# EAGLE schematic dengenver2.0 (EAGLE 9.6.2)
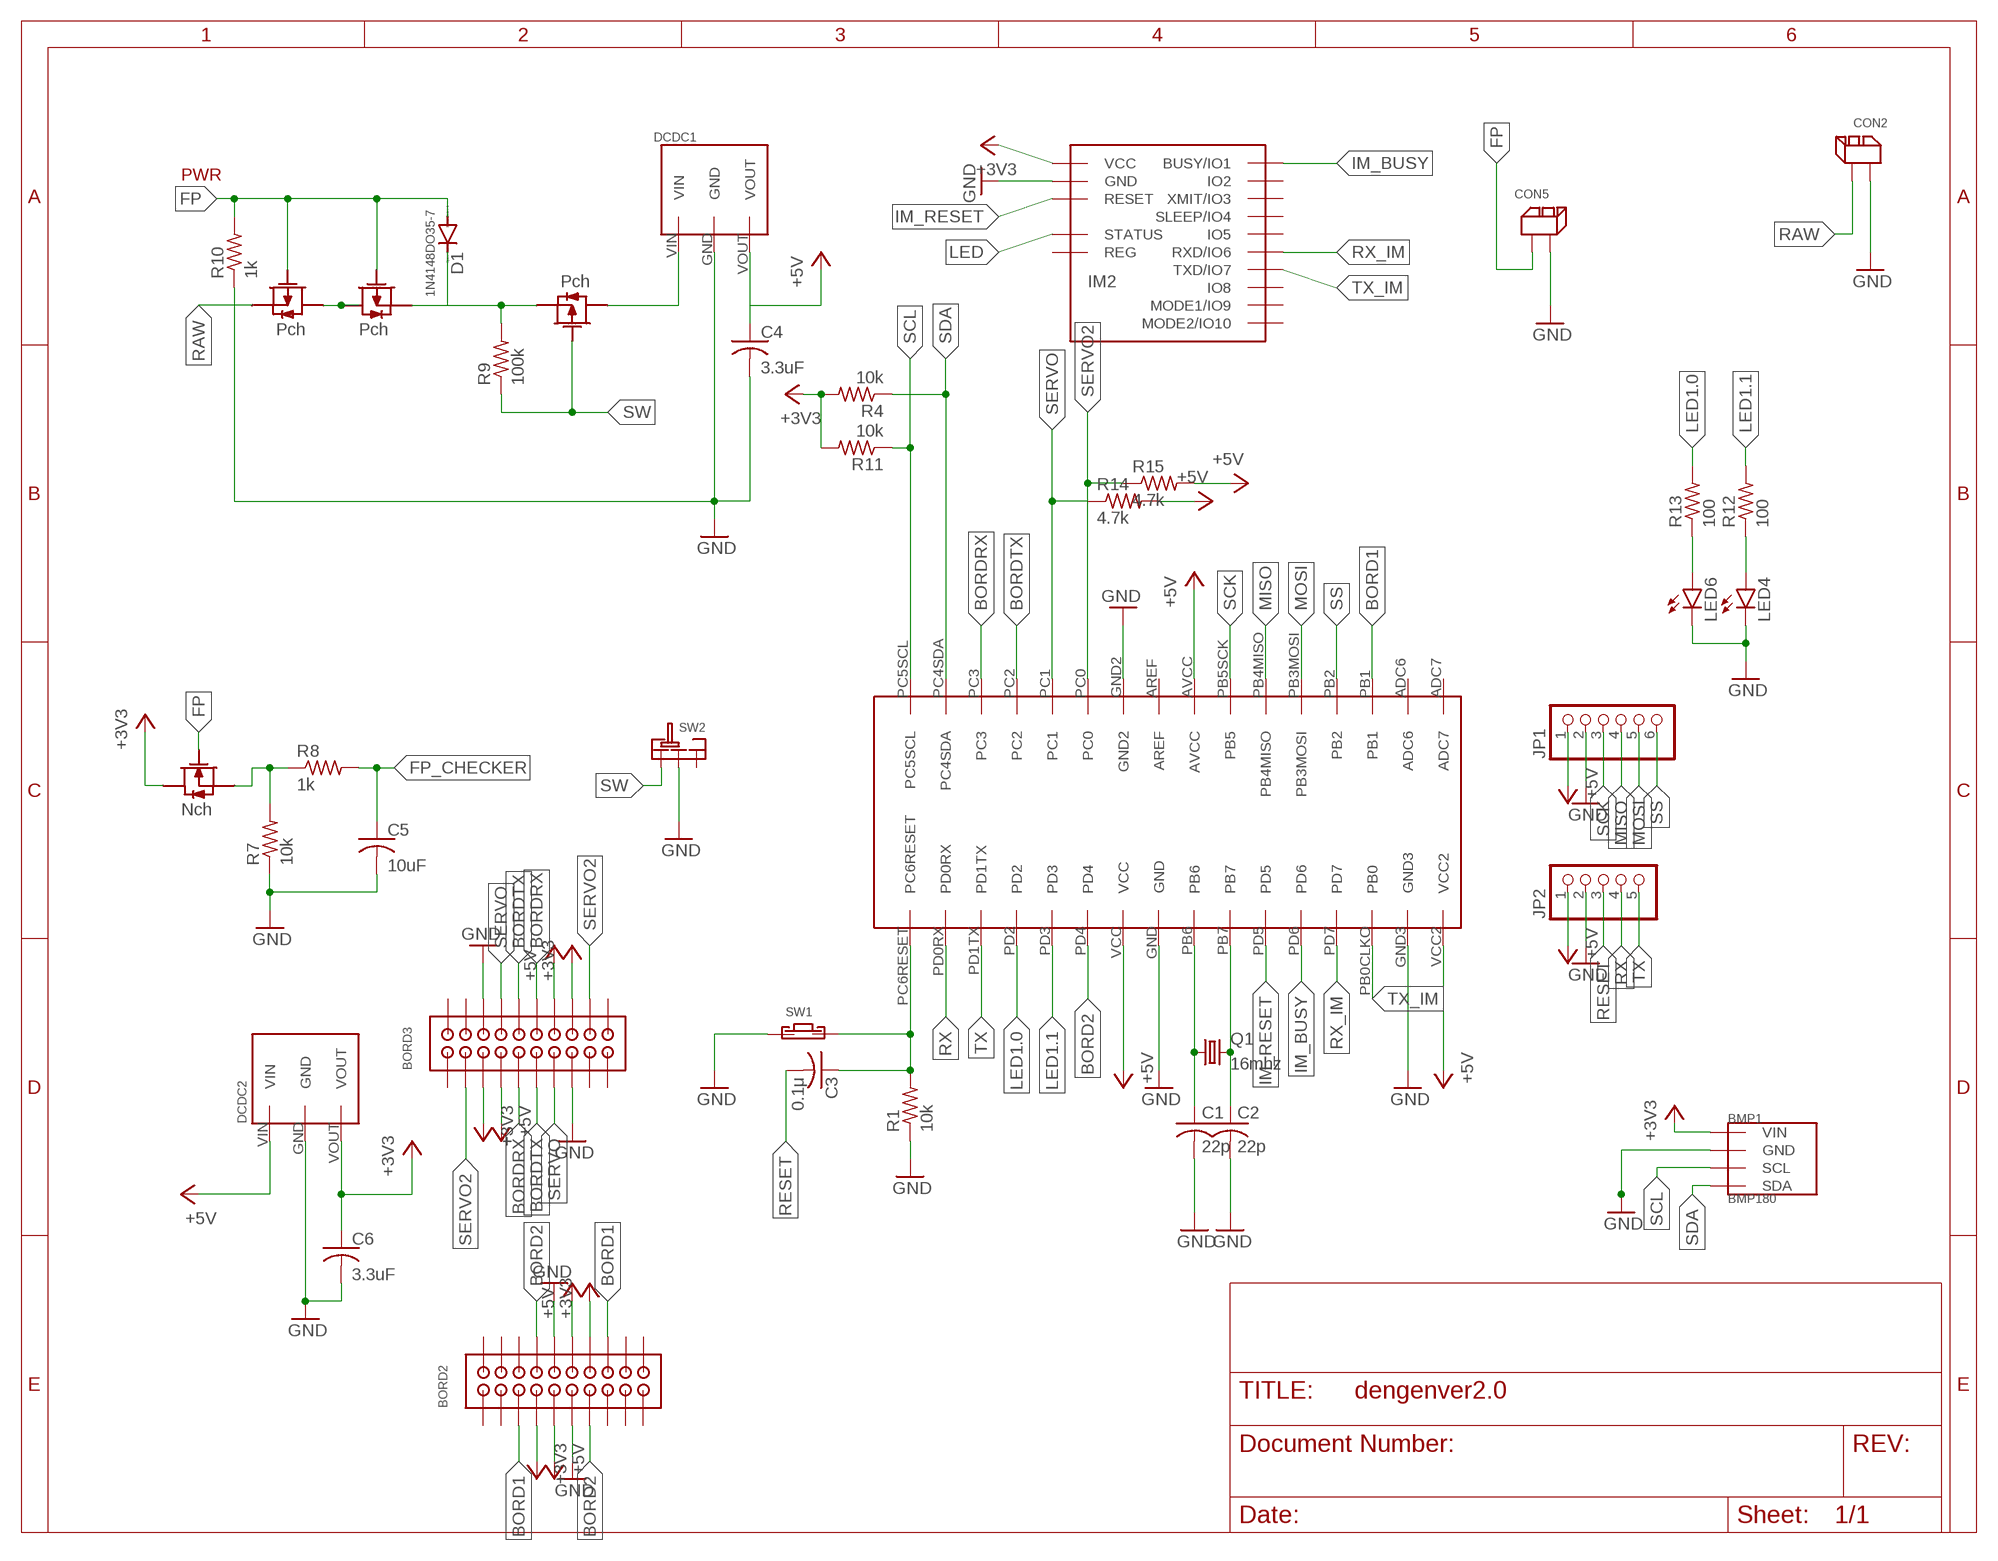
[diagram p0: schematic, sheet 1]

## Parts
BMP1  BMP180  [GY-68]
BORD2  2X10  [2X10]
BORD3  2X10  [2X10]
C1  22p  C-USC1608  [C1608]
C2  22p  C-USC1608  [C1608]
C3  0.1μ  C-USC1608  [C1608]
C4  3.3uF  C-USC1608  [C1608]
C5  10uF  C-USC1608  [C1608]
C6  3.3uF  C-USC1608  [C1608]
CON2  2PIN  [2PIN]
CON5  2PIN  [2PIN]
D1  1N4148DO35-7  [DO35-7]
DCDC1  5V1A_M78AR05-1  [5V1A_M78AR05-1]
DCDC2  3.3V1A_M78AR033-1  [3.3V1A_M78AR033-1]
IM2  IM920_IM920C  [IM920_IM920C]
JP1  PINHD-1X6  [1X06]
JP2  PINHD-1X5  [1X05]
LED4  LED5MM  [LED5MM]
LED6  LED5MM  [LED5MM]
Q1  16mhz  CRYSTALHC49UP  [HC49UP]
R1  10k  R-US_R0603  [R0603]
R4  10k  R-US_R0603  [R0603]
R7  10k  R-US_R0603  [R0603]
R8  1k  R-US_R0603  [R0603]
R9  100k  R-US_R0603  [R0603]
R10  1k  R-US_R0603  [R0603]
R11  10k  R-US_R0603  [R0603]
R12  100  R-US_R0603  [R0603]
R13  100  R-US_R0603  [R0603]
R14  4.7k  R-US_R0603  [R0603]
R15  4.7k  R-US_R0603  [R0603]
SW1  TVAF06-A020B-R  [TVAF06-A020B-R]
SW2  SRIDE_SWITCH  [SRIDE_SWITCH]
U$1  ATMEGA328P-AU  [ATMEGA328P-AU]
U$2  2SJ681-PCH  [2SJ681]
U$3  2SK4017-NCH  [2SK4017]
U$4  2SJ681-PCH  [2SJ681]
U$5  2SJ681-PCH  [2SJ681]

## Nets
+3V3: BMP1.P1(VIN) BORD2.P$7 BORD2.P$14 BORD3.P$5 BORD3.P$16 C6.1 DCDC2.VOUT IM2.$P17(VCC) R4.2 R11.2 U$3.DRAIN
+5V: BORD2.P$9 BORD2.P$12 BORD3.P$7 BORD3.P$14 C4.1 DCDC1.VOUT DCDC2.VIN JP1.1 JP2.1 R14.2 R15.2 U$1.AVCC U$1.VCC U$1.VCC2
+5V1: DCDC1.VIN U$5.DRAIN
BORD1: BORD2.P$5 BORD2.P$16 U$1.PB1
BORD2: BORD2.P$8 BORD2.P$13 U$1.PD4
BORDRX: BORD3.P$9 BORD3.P$12 U$1.PC3
BORDTX: BORD3.P$10 BORD3.P$11 U$1.PC2
FP: CON5.P$1 D1.A R10.2 U$2.GATE U$3.GATE U$4.GATE
FP_CHECKER: C5.1 R8.2
GND: BMP1.P2(GND) BORD2.P$10 BORD2.P$11 BORD3.P$6 BORD3.P$15 C1.2 C2.2 C4.2 C5.2 C6.2 CON2.P$1 CON5.P$2 DCDC1.GND DCDC2.GND IM2.$P18(GND) JP1.2 JP2.2 LED4.K(C) LED6.K(C) R1.1 R7.1 R10.1 SW1.P$1 SW2.LR U$1.GND U$1.GND2 U$1.GND3
IM_BUSY: IM2.$P1(BUSY/IO1) U$1.PD6
IM_RESET: IM2.$P19(RESET) U$1.PD5
LED: IM2.$P15(STATUS)
LED1.0: R13.2 U$1.PD2
LED1.1: R12.2 U$1.PD3
MISO: JP1.4 U$1.PB4MISO
MOSI: JP1.5 U$1.PB3MOSI
N$1: C3.1 R1.2 SW1.P$2 U$1.PC6RESET
N$2: U$2.DRAIN U$4.DRAIN
N$3: D1.C R9.2 U$4.SOURCE U$5.SOURCE
N$9: LED6.A R13.1
N$10: LED4.A R12.1
N$12: C1.1 Q1.1 U$1.PB6
N$13: C2.1 Q1.2 U$1.PB7
N$14: R7.2 R8.1 U$3.SOURCE
RAW: CON2.P$2 U$2.SOURCE
RESET: C3.2 JP2.3
RX: JP2.4 U$1.PD0RX
RX_IM: IM2.$P6(RXD/IO6) U$1.PD7
SCK: JP1.3 U$1.PB5SCK(PB5)
SCL: BMP1.P3(SCL) R11.1 U$1.PC5SCL
SDA: BMP1.P4(SDA) R4.1 U$1.PC4SDA
SERVO: BORD3.P$8 BORD3.P$13 R14.1 U$1.PC1
SERVO2: BORD3.P$3 BORD3.P$18 R15.1 U$1.PC0
SS: JP1.6 U$1.PB2
SW: R9.1 SW2.L U$5.GATE
TX: JP2.5 U$1.PD1TX
TX_IM: IM2.$P7(TXD/IO7) U$1.PB0CLKO(PB0)
Unconnected: BORD2.P$1 BORD2.P$2 BORD2.P$3 BORD2.P$4 BORD2.P$6 BORD2.P$15 BORD2.P$17 BORD2.P$18 BORD2.P$19 BORD2.P$20 BORD3.P$1 BORD3.P$2 BORD3.P$4 BORD3.P$17 BORD3.P$19 BORD3.P$20 IM2.$P2(IO2) IM2.$P3(XMIT/IO3) IM2.$P4(SLEEP/IO4) IM2.$P5(IO5) IM2.$P8(IO8) IM2.$P9(MODE1/IO9) IM2.$P10(MODE2/IO10) IM2.$P16(REG) SW2.R U$1.ADC6 U$1.ADC7 U$1.AREF

## Notes on the sheet
- PWR

## Library data of the parts
BMP1 = BMP180:BMP180
BORD2 BORD3 = PinSocket:2X10
C1-C6 = rcl:C-US: CAPACITOR, American symbol; SPICEPREFIX: C
CON2 CON5 = XR Connector:2PIN
D1 = diode:1N4148: DIODE high speed (Philips)
DCDC1 = DC-DC:5V1A_M78AR05-1
DCDC2 = DC-DC:3.3V1A_M78AR033-1
IM2 = CANSAT12th:IM920_IM920C
JP1 = pinhead:PINHD-1X6: PIN HEADER
JP2 = pinhead:PINHD-1X5: PIN HEADER
LED4 LED6 = led:LED: LED OSRAM: - CHIPLED LG R971, LG N971, LY N971, LG Q971, LY Q971, LO R971, LY R971 LH N974, LH R974 LS Q976, LO Q976, LY Q976 LO Q996 - Hyper CHIPLED LW Q18S LB Q993, LB Q99A, LB R99A - SideLED LS A670, LO A670, LY A670, LG A670, LP A670 LB A673, LV A673, LT A673, LW A673 LH A674 LY A675 LS A676, LA A676, LO A676, LY A676, LW A676 LS A679, LY A679, LG A679 - Hyper Micro SIDELED® LS Y876, LA Y876, LO Y876, LY Y876 LT Y87S - SmartLED LW L88C, LW L88S LB L89C, LB L89S, LG L890 LS L89K, LO L89K, LY L89K LS L896, LA L896, LO L896, LY L896 - TOPLED LS T670, LO T670, LY T670, LG T670, LP T670 LSG T670, LSP T670, LSY T670, LOP T670, LYG T670 LG T671, LOG T671, LSG T671 LB T673, LV T673, LT T673, LW T673 LH T674 LS T676, LA T676, LO T676, LY T676, LB T676, LH T676, LSB T676, LW T676 LB T67C, LV T67C, LT T67C, LS T67K, LO T67K, LY T67K, LW E67C LS E67B, LA E67B, LO E67B, LY E67B, LB E67C, LV E67C, LT E67C LW T67C LS T679, LY T679, LG T679 LS T770, LO T770, LY T770, LG T770, LP T770 LB T773, LV T773, LT T773, LW T773 LH T774 LS E675, LA E675, LY E675, LS T675 LS T776, LA T776, LO T776, LY T776, LB T776 LHGB T686 LT T68C, LB T68C - Hyper Mini TOPLED® LB M676 - Mini TOPLED Santana® LG M470 LS M47K, LO M47K, LY M47K Source: http://www.osram.convergy.de LUXEON: - LUMILED® LXK2-PW12-R00, LXK2-PW12-S00, LXK2-PW14-U00, LXK2-PW14-V00 LXK2-PM12-R00, LXK2-PM12-S00, LXK2-PM14-U00 LXK2-PE12-Q00, LXK2-PE12-R00, LXK2-PE12-S00, LXK2-PE14-T00, LXK2-PE14-U00 LXK2-PB12-K00, LXK2-PB12-L00, LXK2-PB12-M00, LXK2-PB14-N00, LXK2-PB14-P00, LXK2-PB14-Q00 LXK2-PR12-L00, LXK2-PR12-M00, LXK2-PR14-Q00, LXK2-PR14-R00 LXK2-PD12-Q00, LXK2-PD12-R00, LXK2-PD12-S00 LXK2-PH12-R00, LXK2-PH12-S00 LXK2-PL12-P00, LXK2-PL12-Q00, LXK2-PL12-R00 Source: www.luxeon.com KINGBRIGHT: KA-3528ASYC Source: www.kingbright.com
Q1 = crystal:CRYSTAL: CRYSTAL; OC_FARNELL: unknown; OC_NEWARK: unknown
R1 R4 R7-R15 = rcl:R-US_: RESISTOR, American symbol; SPICEPREFIX: R
SW1 = Tact switch:TVAF06-A020B-R
SW2 = Sride Switch:SRIDE_SWITCH
U$1 = ATmega328p-PU:ATMEGA328P-AU
U$2 U$4 U$5 = mosfet:2SJ681-PCH
U$3 = mosfet:2SK4017-NCH

## Net classes
0 default: width 0.406 mm